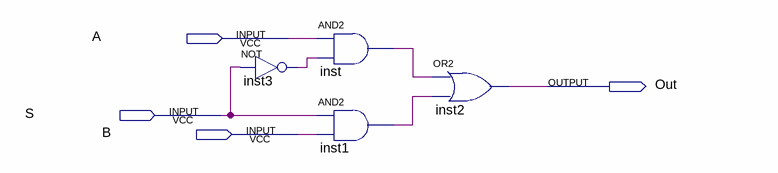
[diagram p0: schematic sheet]
// Quartus schematic Mux2to1_1bit.bdf as structural Verilog: 4 symbols, 4 pins
module Mux2to1_1bit (
  input  A,
  input  S,
  input  B,
  output Out
);

  wire inst1_out, inst3_out, inst_out;

  not inst3 (inst3_out, S);
  and inst (inst_out, A, inst3_out);
  and inst1 (inst1_out, S, B);
  or inst2 (Out, inst_out, inst1_out);
endmodule
